# Altium schematic sheet FPGA Power.SchDoc
size A; SheetNumber: 3; SheetTotal: 8
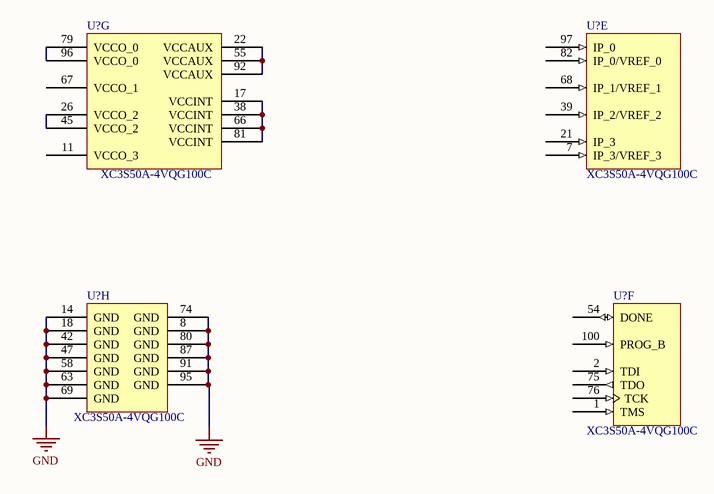
[diagram p0: FPGA Power.SchDoc]

## Parts
(Parts that share a designator on the sheet are numbered #1, #2 ... from top to bottom, then left to right.)
U?#1  XC3S50A-4VQG100C  [VQG100_N]  (part G of 8)
U?#2  XC3S50A-4VQG100C  [VQG100_N]  (part E of 8)
U?#3  XC3S50A-4VQG100C  [VQG100_N]  (part H of 8)
U?#4  XC3S50A-4VQG100C  [VQG100_N]  (part F of 8)

## Nets
GND: U?#3.8(GND) U?#3.14(GND) U?#3.18(GND) U?#3.42(GND) U?#3.47(GND) U?#3.58(GND) U?#3.63(GND) U?#3.69(GND) U?#3.74(GND) U?#3.80(GND) U?#3.87(GND) U?#3.91(GND) U?#3.95(GND)
NetU?#1_17: U?#1.17(VCCINT) U?#1.38(VCCINT) U?#1.66(VCCINT) U?#1.81(VCCINT)
NetU?#1_22: U?#1.22(VCCAUX) U?#1.55(VCCAUX) U?#1.92(VCCAUX)
NetU?#1_26: U?#1.26(VCCO_2) U?#1.45(VCCO_2)
NetU?#1_79: U?#1.79(VCCO_0) U?#1.96(VCCO_0)

Not connected (* = marked no-connect by the designer): U?#1 11(VCCO_3) 67(VCCO_1); U?#2 7(IP_3/VREF_3) 21(IP_3) 39(IP_2/VREF_2) 68(IP_1/VREF_1) 82(IP_0/VREF_0) 97(IP_0); U?#4 1(TMS) 2(TDI) 54(DONE) 75(TDO) 76(TCK) 100(PROG_B)

## Library data of the parts
U?#1-U?#4 = CMP-0049-00079-1: Spartan-3A I/O Optimized FPGA, 68 User I/Os, 100-Pin VQFP, Standard Performance, Commercial Grade, Pb-Free; PackageReference: VQG100; DatasheetVersion: ver1.8, Mar-2009; PackageDescription: 100-Pin Very Thin Quad Flat Pack (VQG100) - Pb-Free; PackageVersion: ver1.2.1, Feb-2007; Code_JEDEC: MS-026-AED